# EAGLE design AJH_MM_v1_0 (EAGLE 9.6.2)
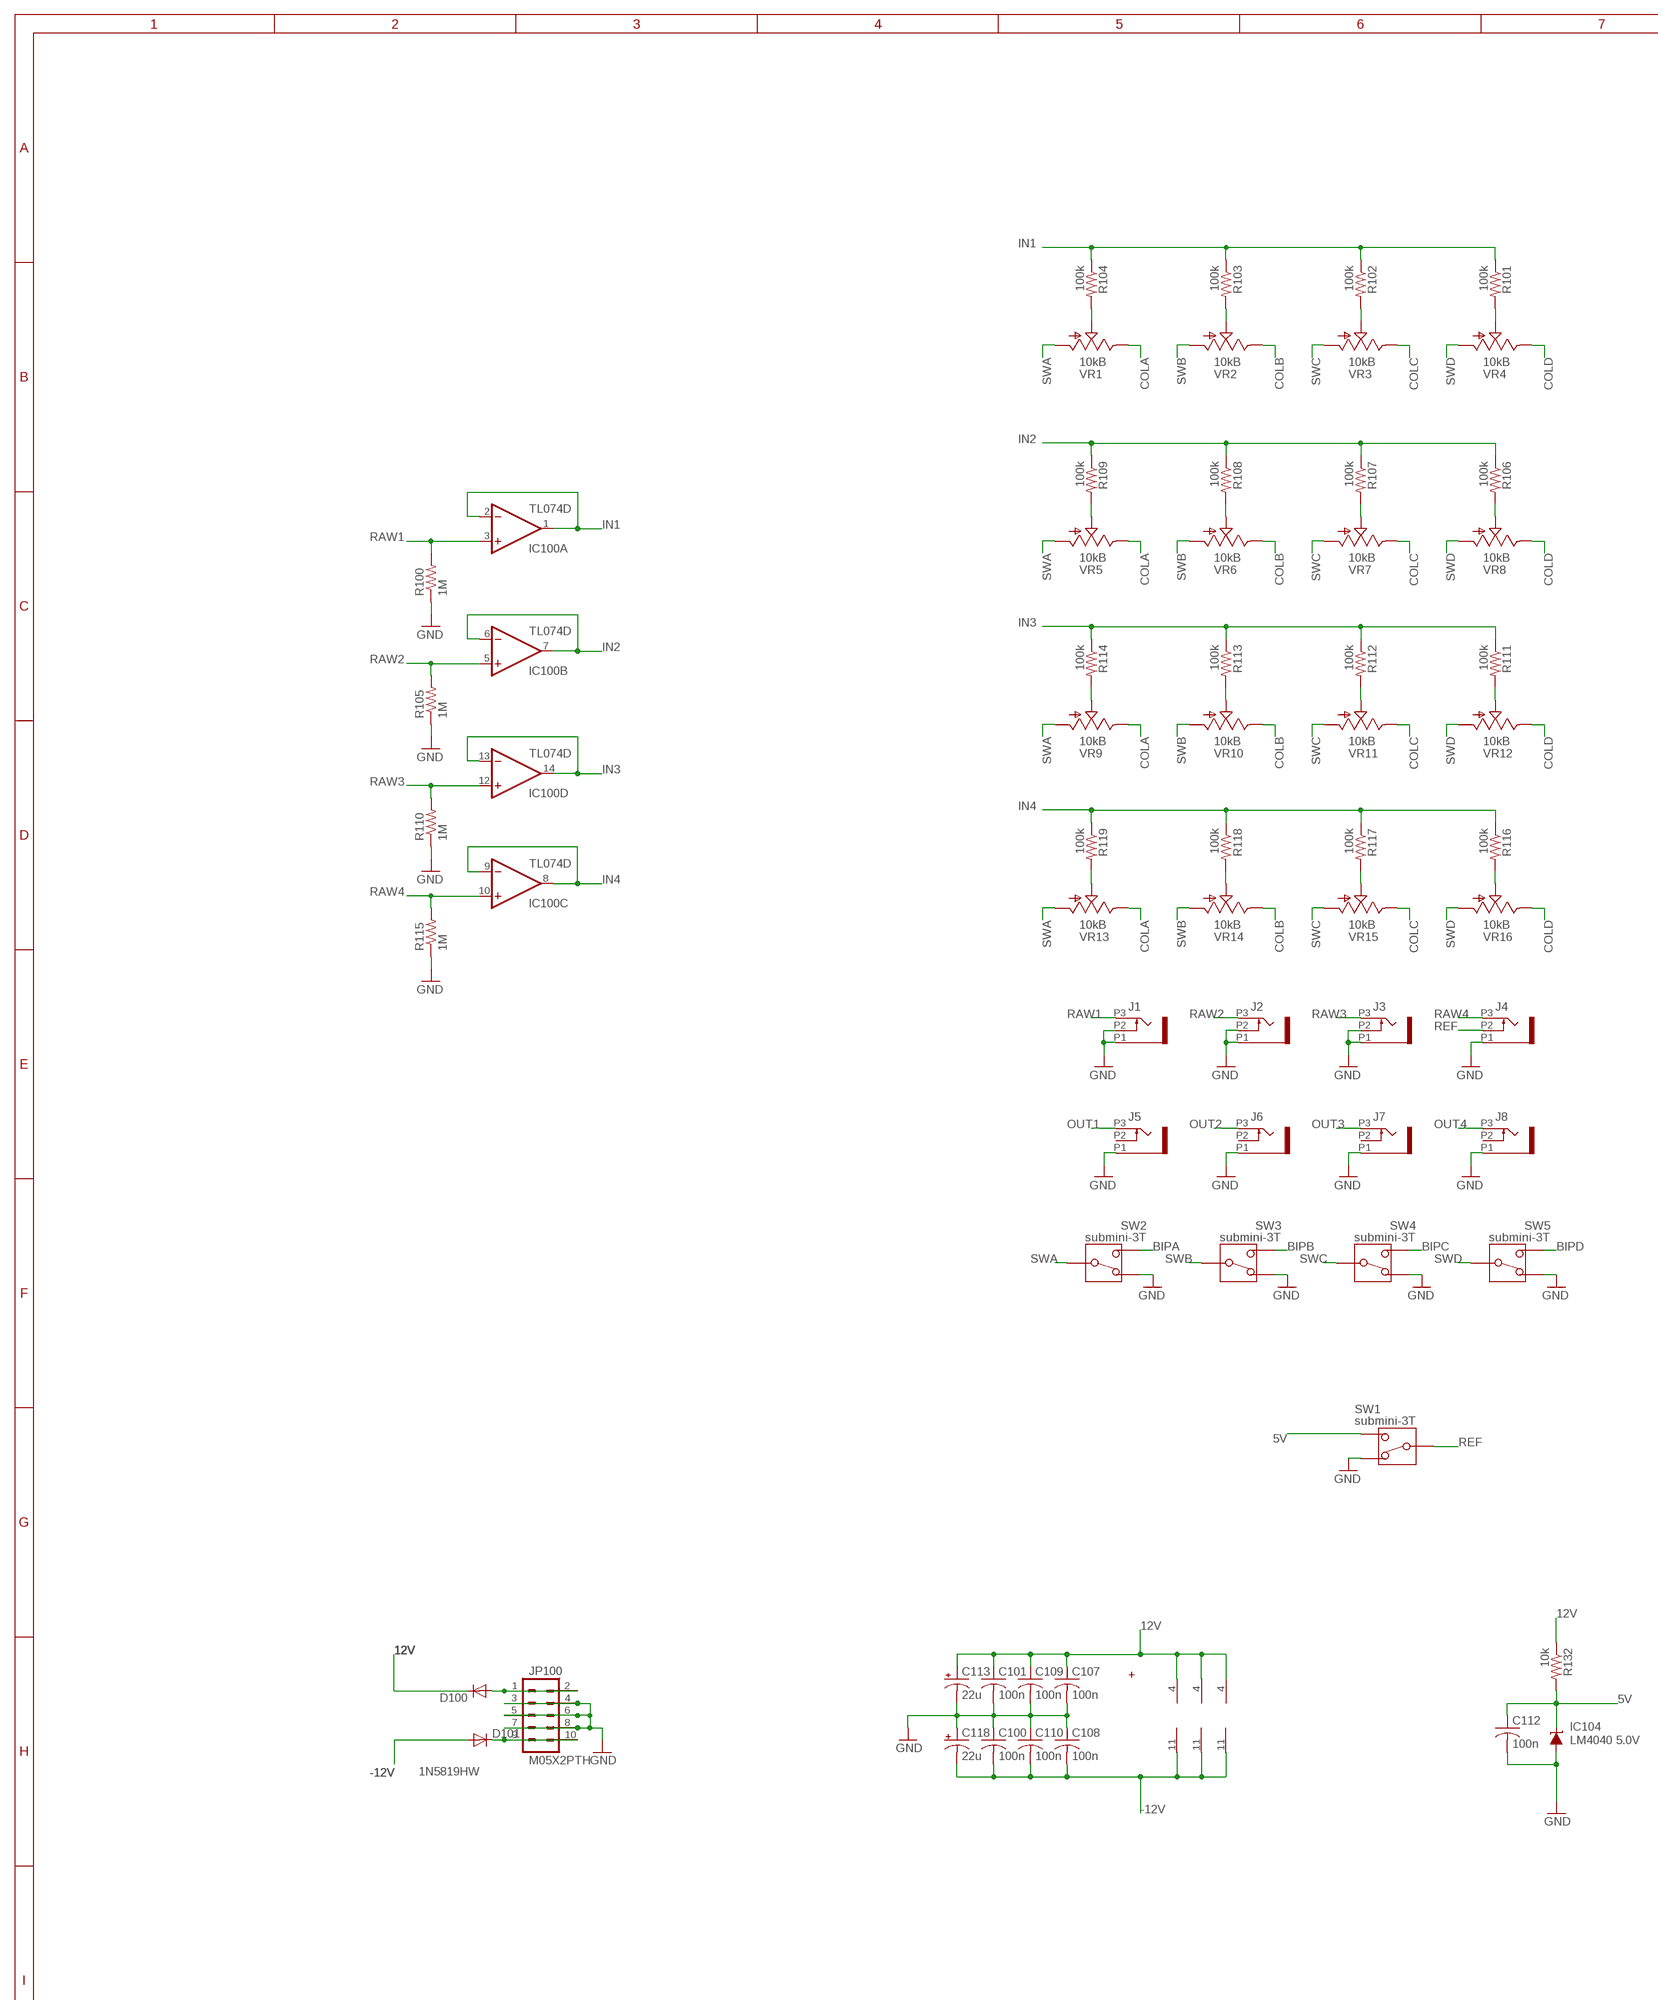
[diagram p0: schematic, sheet 1, part 1 of 2]
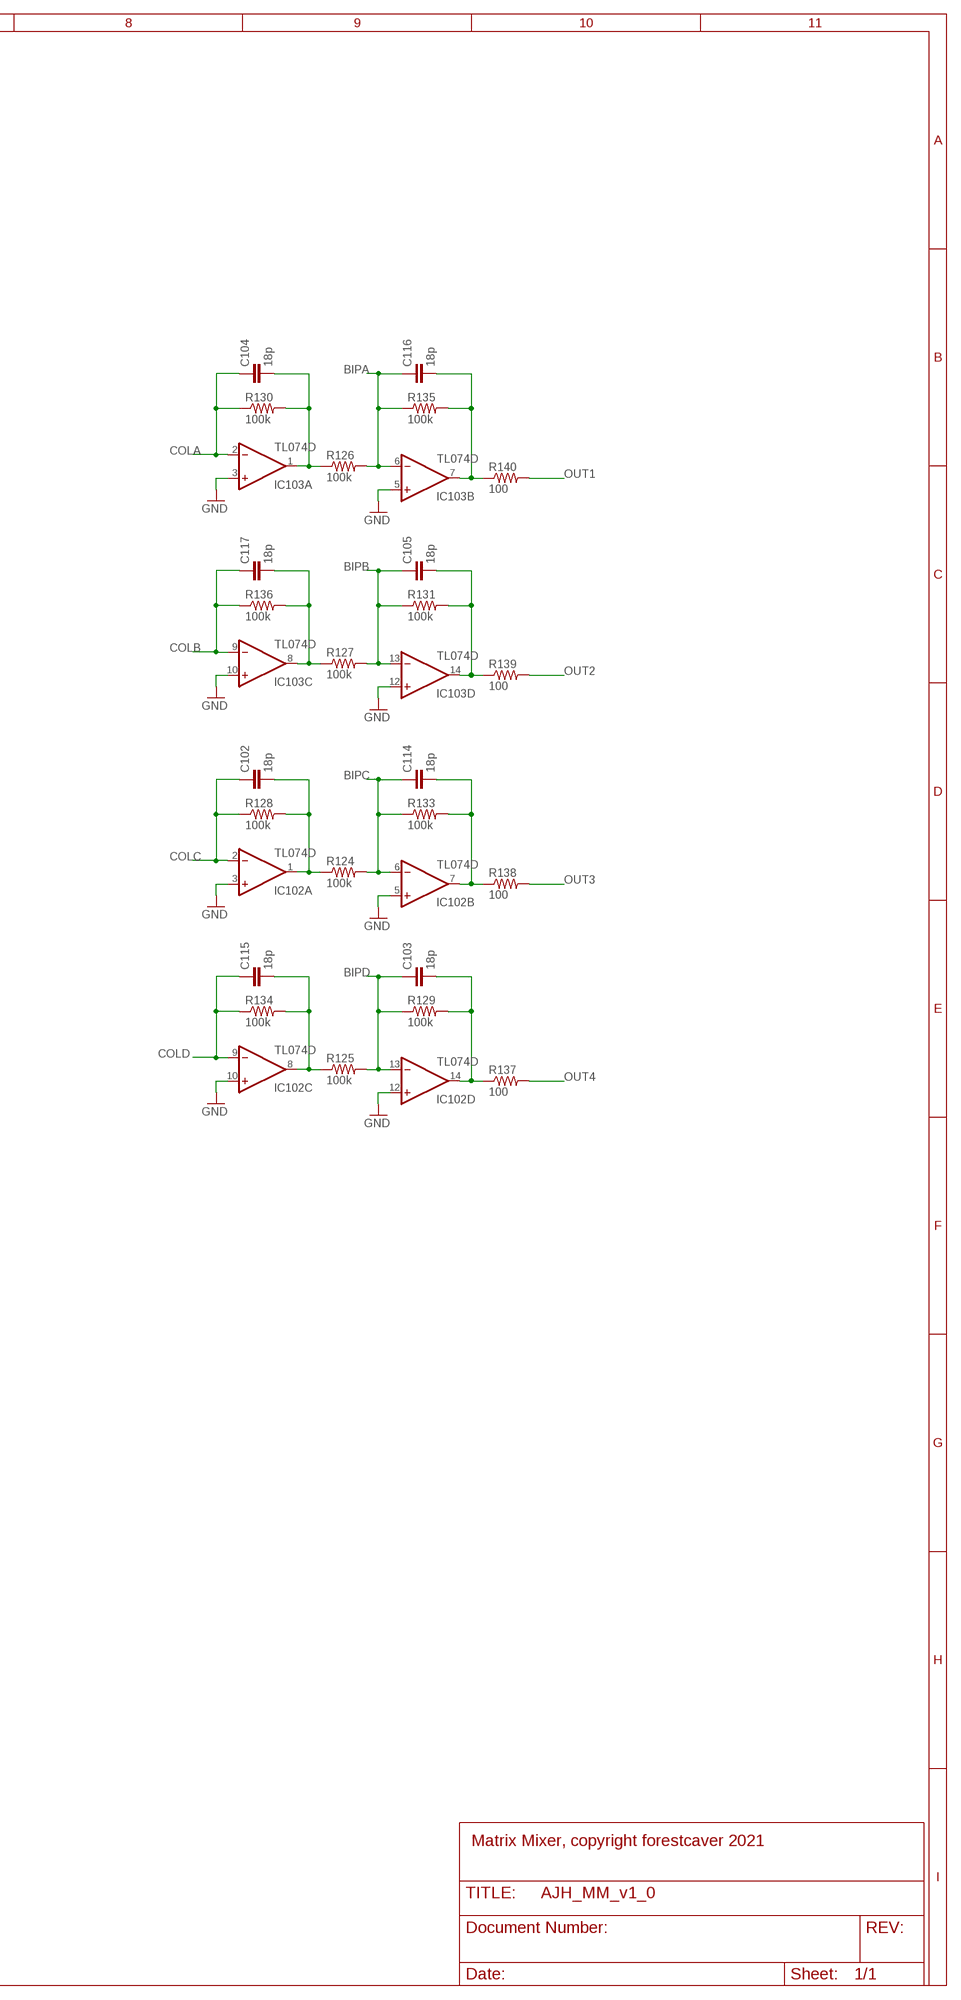
[diagram p1: schematic, sheet 1, part 2 of 2]

## Parts
C100  100n  C-USC0603  [C0603]
C101  100n  C-USC0603  [C0603]
C102  18p  C-EUC0603  [C0603]
C103  18p  C-EUC0603  [C0603]
C104  18p  C-EUC0603  [C0603]
C105  18p  C-EUC0603  [C0603]
C107  100n  C-USC0603  [C0603]
C108  100n  C-USC0603  [C0603]
C109  100n  C-USC0603  [C0603]
C110  100n  C-USC0603  [C0603]
C112  100n  C-USC0603  [C0603]
C113  22u  CPOL-USB  [PANASONIC_B]
C114  18p  C-EUC0603  [C0603]
C115  18p  C-EUC0603  [C0603]
C116  18p  C-EUC0603  [C0603]
C117  18p  C-EUC0603  [C0603]
C118  22u  CPOL-USB  [PANASONIC_B]
D100  1N5819HW  DIODE-SOD123  [SOD123]
D101  1N5819HW  DIODE-SOD123  [SOD123]
IC100  TL074D  [SO14]
IC102  TL074D  [SO14]
IC103  TL074D  [SO14]
IC104  LM4040 5.0V  LM4041C12DBZ  [DBZ_R-PDSO-G3]
J1  PJ301_THONKICONN6  [WQP_PJ_301M6]
J2  PJ301_THONKICONN6  [WQP_PJ_301M6]
J3  PJ301_THONKICONN6  [WQP_PJ_301M6]
J4  PJ301_THONKICONN6  [WQP_PJ_301M6]
J5  PJ301_THONKICONN6  [WQP_PJ_301M6]
J6  PJ301_THONKICONN6  [WQP_PJ_301M6]
J7  PJ301_THONKICONN6  [WQP_PJ_301M6]
J8  PJ301_THONKICONN6  [WQP_PJ_301M6]
JP100  M05X2PTH  [AVR_ICSP]
R100  1M  R-US_R0603  [R0603]
R101  100k  R-US_R0603  [R0603]
R102  100k  R-US_R0603  [R0603]
R103  100k  R-US_R0603  [R0603]
R104  100k  R-US_R0603  [R0603]
R105  1M  R-US_R0603  [R0603]
R106  100k  R-US_R0603  [R0603]
R107  100k  R-US_R0603  [R0603]
R108  100k  R-US_R0603  [R0603]
R109  100k  R-US_R0603  [R0603]
R110  1M  R-US_R0603  [R0603]
R111  100k  R-US_R0603  [R0603]
R112  100k  R-US_R0603  [R0603]
R113  100k  R-US_R0603  [R0603]
R114  100k  R-US_R0603  [R0603]
R115  1M  R-US_R0603  [R0603]
R116  100k  R-US_R0603  [R0603]
R117  100k  R-US_R0603  [R0603]
R118  100k  R-US_R0603  [R0603]
R119  100k  R-US_R0603  [R0603]
R124  100k  R-US_R0603  [R0603]
R125  100k  R-US_R0603  [R0603]
R126  100k  R-US_R0603  [R0603]
R127  100k  R-US_R0603  [R0603]
R128  100k  R-US_R0603  [R0603]
R129  100k  R-US_R0603  [R0603]
R130  100k  R-US_R0603  [R0603]
R131  100k  R-US_R0603  [R0603]
R132  10k  R-US_R0603  [R0603]
R133  100k  R-US_R0603  [R0603]
R134  100k  R-US_R0603  [R0603]
R135  100k  R-US_R0603  [R0603]
R136  100k  R-US_R0603  [R0603]
R137  100  R-US_R0603  [R0603]
R138  100  R-US_R0603  [R0603]
R139  100  R-US_R0603  [R0603]
R140  100  R-US_R0603  [R0603]
SW1  submini-3T  SPDTT  [SPDT-SUB]
SW2  submini-3T  SPDTT  [SPDT-SUB]
SW3  submini-3T  SPDTT  [SPDT-SUB]
SW4  submini-3T  SPDTT  [SPDT-SUB]
SW5  submini-3T  SPDTT  [SPDT-SUB]
VR1  10kB  POT_USVERTICAL  [ALPS_POT_VERTICAL]
VR2  10kB  POT_USVERTICAL  [ALPS_POT_VERTICAL]
VR3  10kB  POT_USVERTICAL  [ALPS_POT_VERTICAL]
VR4  10kB  POT_USVERTICAL  [ALPS_POT_VERTICAL]
VR5  10kB  POT_USVERTICAL  [ALPS_POT_VERTICAL]
VR6  10kB  POT_USVERTICAL  [ALPS_POT_VERTICAL]
VR7  10kB  POT_USVERTICAL  [ALPS_POT_VERTICAL]
VR8  10kB  POT_USVERTICAL  [ALPS_POT_VERTICAL]
VR9  10kB  POT_USVERTICAL  [ALPS_POT_VERTICAL]
VR10  10kB  POT_USVERTICAL  [ALPS_POT_VERTICAL]
VR11  10kB  POT_USVERTICAL  [ALPS_POT_VERTICAL]
VR12  10kB  POT_USVERTICAL  [ALPS_POT_VERTICAL]
VR13  10kB  POT_USVERTICAL  [ALPS_POT_VERTICAL]
VR14  10kB  POT_USVERTICAL  [ALPS_POT_VERTICAL]
VR15  10kB  POT_USVERTICAL  [ALPS_POT_VERTICAL]
VR16  10kB  POT_USVERTICAL  [ALPS_POT_VERTICAL]

## Nets
5V: C112.1 IC104.1(C) R132.2 SW1.P$1
12V [power]: C101.1 C107.1 C109.1 C113.+ D100.C IC100.4(P:V+) IC102.4(P:V+) IC103.4(P:V+) R132.1
-12V [power]: C100.2 C108.2 C110.2 C118.- D101.A IC100.11(P:V-) IC102.11(P:V-) IC103.11(P:V-)
BIPA: C116.1 IC103.6(B:-IN) R126.2 R135.1 SW2.P$1
BIPB: C105.1 IC103.13(D:-IN) R127.2 R131.1 SW3.P$1
BIPC: C114.1 IC102.6(B:-IN) R124.2 R133.1 SW4.P$1
BIPD: C103.1 IC102.13(D:-IN) R125.2 R129.1 SW5.P$1
COLA: C104.1 IC103.2(A:-IN) R130.1 VR1.P$1(E) VR5.P$1(E) VR9.P$1(E) VR13.P$1(E)
COLB: C117.1 IC103.9(C:-IN) R136.1 VR2.P$1(E) VR6.P$1(E) VR10.P$1(E) VR14.P$1(E)
COLC: C102.1 IC102.2(A:-IN) R128.1 VR3.P$1(E) VR7.P$1(E) VR11.P$1(E) VR15.P$1(E)
COLD: C115.1 IC102.9(C:-IN) R134.1 VR4.P$1(E) VR8.P$1(E) VR12.P$1(E) VR16.P$1(E)
GND [power]: C100.1 C101.2 C107.2 C108.1 C109.2 C110.1 C112.2 C113.- C118.+ IC102.3(A:+IN) IC102.5(B:+IN) IC102.10(C:+IN) IC102.12(D:+IN) IC103.3(A:+IN) IC103.5(B:+IN) IC103.10(C:+IN) IC103.12(D:+IN) IC104.2(A) J1.P1 J1.P2 J2.P1 J2.P2 J3.P1 J3.P2 J4.P1 J5.P1 J6.P1 J7.P1 J8.P1 JP100.3 JP100.4 JP100.5 JP100.6 JP100.7 JP100.8 R100.1 R105.1 R110.1 R115.1 SW1.P$3 SW2.P$3 SW3.P$3 SW4.P$3 SW5.P$3
IN1: IC100.1(A:OUT) IC100.2(A:-IN) R101.1 R102.1 R103.1 R104.1
IN2: IC100.6(B:-IN) IC100.7(B:OUT) R106.1 R107.1 R108.1 R109.1
IN3: IC100.13(D:-IN) IC100.14(D:OUT) R111.1 R112.1 R113.1 R114.1
IN4: IC100.8(C:OUT) IC100.9(C:-IN) R116.1 R117.1 R118.1 R119.1
N$2: R104.2 VR1.P$2(S)
N$3: R103.2 VR2.P$2(S)
N$4: R102.2 VR3.P$2(S)
N$5: R101.2 VR4.P$2(S)
N$6: D100.A JP100.1 JP100.2
N$7: R114.2 VR9.P$2(S)
N$8: C117.2 IC103.8(C:OUT) R127.1 R136.2
N$9: R113.2 VR10.P$2(S)
N$10: R112.2 VR11.P$2(S)
N$11: R111.2 VR12.P$2(S)
N$12: C104.2 IC103.1(A:OUT) R126.1 R130.2
N$13: R119.2 VR13.P$2(S)
N$14: R118.2 VR14.P$2(S)
N$15: R117.2 VR15.P$2(S)
N$16: R116.2 VR16.P$2(S)
N$18: C116.2 IC103.7(B:OUT) R135.2 R140.1
N$20: D101.C JP100.9 JP100.10
N$21: C105.2 IC103.14(D:OUT) R131.2 R139.1
N$22: R109.2 VR5.P$2(S)
N$24: R108.2 VR6.P$2(S)
N$28: C102.2 IC102.1(A:OUT) R124.1 R128.2
N$30: C114.2 IC102.7(B:OUT) R133.2 R138.1
N$31: C115.2 IC102.8(C:OUT) R125.1 R134.2
N$33: C103.2 IC102.14(D:OUT) R129.2 R137.1
N$34: R107.2 VR7.P$2(S)
N$38: R106.2 VR8.P$2(S)
OUT1: J5.P3 R140.2
OUT2: J6.P3 R139.2
OUT3: J7.P3 R138.2
OUT4: J8.P3 R137.2
RAW1: IC100.3(A:+IN) J1.P3 R100.2
RAW2: IC100.5(B:+IN) J2.P3 R105.2
RAW3: IC100.12(D:+IN) J3.P3 R110.2
RAW4: IC100.10(C:+IN) J4.P3 R115.2
REF: J4.P2 SW1.P$2
SWA: SW2.P$2 VR1.P$3(A) VR5.P$3(A) VR9.P$3(A) VR13.P$3(A)
SWB: SW3.P$2 VR2.P$3(A) VR6.P$3(A) VR10.P$3(A) VR14.P$3(A)
SWC: SW4.P$2 VR3.P$3(A) VR7.P$3(A) VR11.P$3(A) VR15.P$3(A)
SWD: SW5.P$2 VR4.P$3(A) VR8.P$3(A) VR12.P$3(A) VR16.P$3(A)
Unconnected: J5.P2 J6.P2 J7.P2 J8.P2

## Notes on the sheet
- +
- Matrix Mixer, copyright forestcaver 2021

## Library data of the parts
C100 C101 C107-C110 C112 = rcl:C-US: CAPACITOR, American symbol
C102-C105 C114-C117 = resistor:C-EU: CAPACITOR, European symbol
C113 C118 = rcl:CPOL-US: POLARIZED CAPACITOR, American symbol
D100 D101 = diode:DIODE-: DIODE
IC100 IC102 IC103 = linear:TL074: OP AMP
IC104 = texas:LM4041: PRECISION MICROPOWER SHUNT VOLTAGE REFERENCE Source: http://focus.ti.com/lit/ds/slcs146e/slcs146e.pdf
J1-J8 = og-pj301_variations:PJ301_THONKICONN
JP100 = og-header:M05X2: Header 5x2 Standard 10-pin dual row 0.1" header. Commonly used with AVR-ISP. Use with Spark Fun Electronics SKU: PRT-00778
R100-R119 R124-R140 = resistor:R-US_: RESISTOR, American symbol
SW1-SW5 = malekko main:SPDT: SPDT Switch
VR1-VR16 = og-pots:POT_US

## Net classes
1 power: width 0.178 mm, drill 0.305 mm, clearance 0.178 mm to class 0, clearance 0.178 mm

## Board
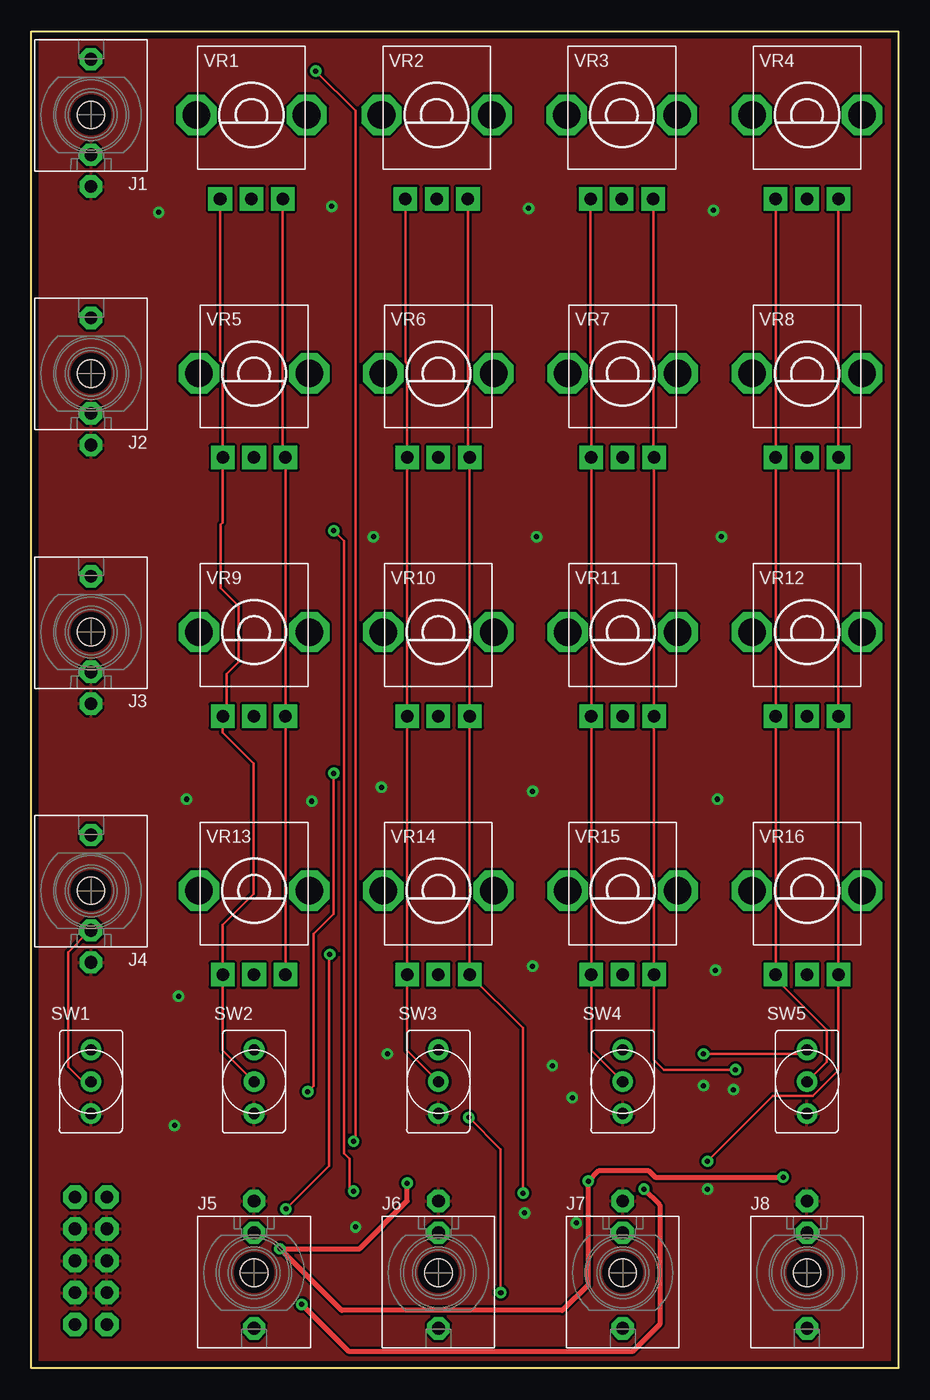
[diagram p2: board, top side]
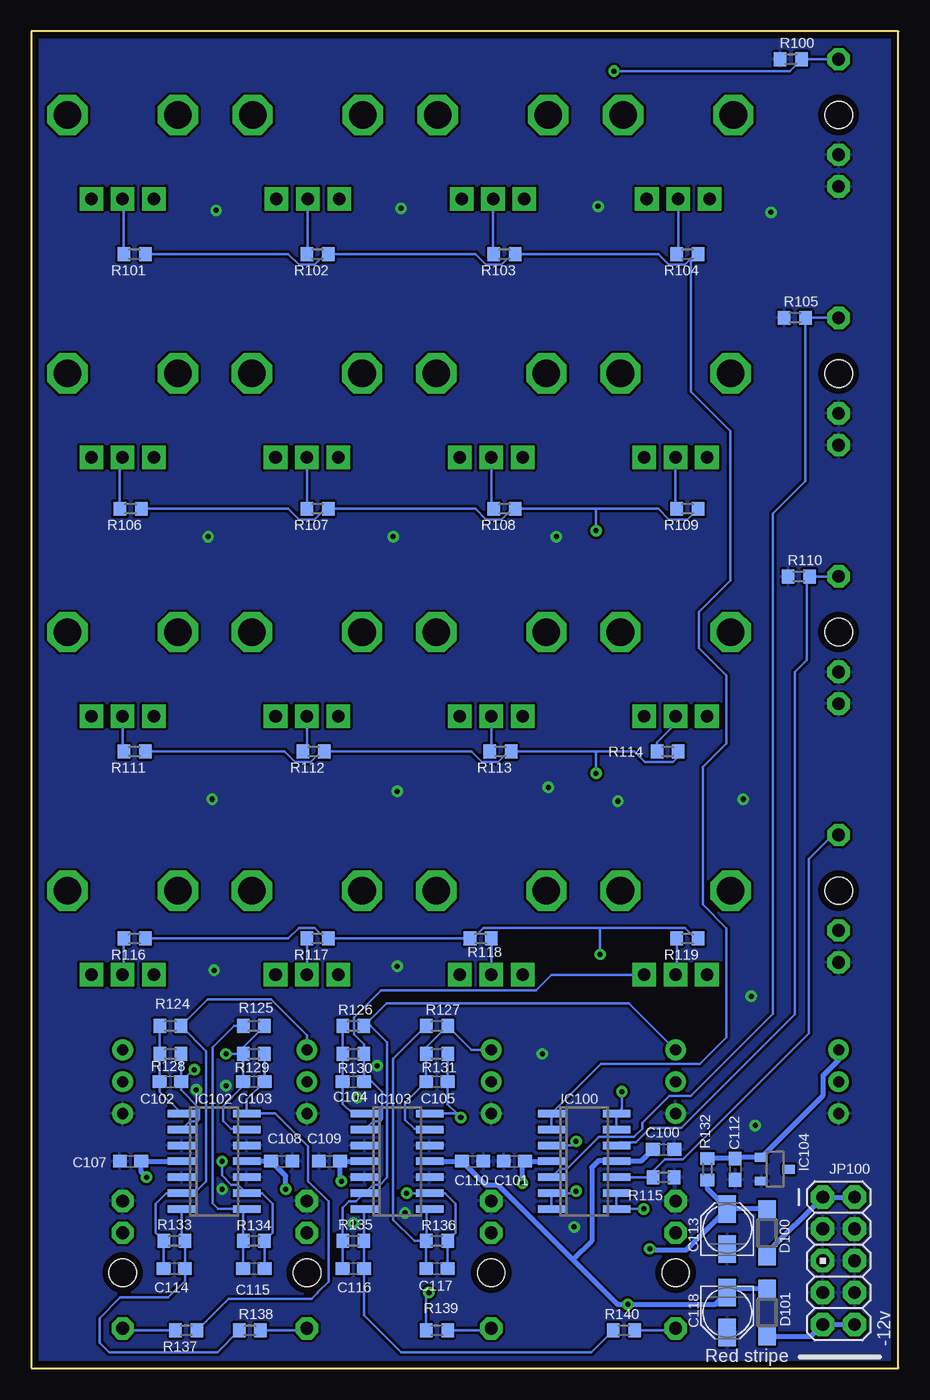
[diagram p3: board, bottom side, seen from below]

Size 69.2 x 106.68 mm. Coordinates in mm from the lower left corner, seen from the top.
Outline: 0,0 0,106.68 69.2,106.68 69.2,0 0,0
Copper layers (1*16): Top 0.035mm / dielectric 1.5mm / Bottom 0.035mm
Design rules "jinx": minimum track width 8mil, minimum drill 0.4mm, track to track 8mil, track to pad 8mil, pad to pad 8mil, via to via 8mil, smd to smd 8mil, copper to edge 20mil, drill to drill 8mil, minimum pad ring 8mil, minimum via ring 10mil, stop-mask expansion 3mil, vias tented up to drill 25mil, thermal gap 8mil

### Footprints (pad centres in the part's own frame; a part is rotated, then mirrored left to right if it is on the bottom)
C0603 = smd 1.1 x 1: 1 -0.85,0; 2 0.85,0
PANASONIC_B = smd 2.2 x 1.4: + 1.6,0; - -1.6,0
SOD123 = smd 1.4 x 1.4: A 1.9,0; C -1.9,0
SO14 = smd 0.6 x 2.2: 1 -3.81,-2.6; 2 -2.54,-2.6; 3 -1.27,-2.6; 4 0,-2.6; 5 1.27,-2.6; 6 2.54,-2.6; 7 3.81,-2.6; 8 3.81,2.6; 9 2.54,2.6; 10 1.27,2.6; 11 0,2.6; 12 -1.27,2.6; 13 -2.54,2.6; 14 -3.81,2.6
DBZ_R-PDSO-G3 = smd 0.7 x 1: 1 -0.95,-1.1; 2 0.95,-1.1; 3 0,1.1
WQP_PJ_301M6 = drill 1.016 pad 1.778 octagon: P1 0,-5.715; P2 0,-3.175; P3 0,4.445 | hole 2.2: 0,0
AVR_ICSP = drill 1.016 pad 1.88 octagon: 1 -1.27,5.08; 2 1.27,5.08; 3 -1.27,2.54; 4 1.27,2.54; 5 -1.27,0; 6 1.27,0; 7 -1.27,-2.54; 8 1.27,-2.54; 9 -1.27,-5.08; 10 1.27,-5.08
R0603 = smd 1 x 1.1: 1 -0.85,0; 2 0.85,0
SPDT-SUB = drill 0.889 pad 1.651: P$1 0,2.54; P$2 0,0; P$3 0,-2.54
ALPS_POT_VERTICAL = drill 1 pad 1.88 square: P$1 -2.5,6.7; P$2 0,6.7; P$3 2.5,6.7 | drill 2.2 pad 3.175 octagon: P$4 -4.4,0; P$5 4.4,0

### Placement (x,y rotation side)
C100  18.73,17.46 180 bottom
C101  30.64,16.51 180 bottom
C102  58.1,22.86 180 bottom
C103  51.44,22.86 0 bottom
C104  43.5,22.86 180 bottom
C105  36.83,22.86 0 bottom
C107  61.28,16.51 180 bottom
C108  49.21,16.51 180 bottom
C109  45.4,16.51 180 bottom
C110  33.97,16.51 180 bottom
C112  13.02,15.88 270 bottom
C113  13.65,11.11 90 bottom
C114  57.78,7.94 0 bottom
C115  51.44,7.94 180 bottom
C116  43.5,7.94 0 bottom
C117  36.83,7.94 180 bottom
C118  13.65,4.45 270 bottom
D100  10.48,10.79 270 bottom
D101  10.48,4.45 90 bottom
IC100  25.08,16.51 270 bottom
IC102  54.61,16.51 270 bottom
IC103  40.01,16.51 270 bottom
IC104  9.84,15.88 270 bottom
J1  4.76,100.01 0 top
J2  4.76,79.38 0 top
J3  4.76,58.74 0 top
J4  4.76,38.1 0 top
J5  17.78,7.62 180 top
J6  32.49,7.62 180 top
J7  47.2,7.62 180 top
J8  61.91,7.62 180 top
JP100  4.76,8.57 0 bottom
R100  8.57,104.46 0 bottom
R101  60.96,88.9 180 bottom
R102  46.35,88.9 180 bottom
R103  31.43,88.9 180 bottom
R104  16.83,88.9 180 bottom
R105  8.26,83.82 0 bottom
R106  61.28,68.58 180 bottom
R107  46.35,68.58 180 bottom
R108  31.43,68.58 180 bottom
R109  16.83,68.58 180 bottom
R110  7.94,63.18 0 bottom
R111  60.96,49.21 180 bottom
R112  46.67,49.21 180 bottom
R113  31.75,49.21 180 bottom
R114  18.41,49.21 180 bottom
R115  18.73,15.24 180 bottom
R116  60.96,34.29 180 bottom
R117  46.35,34.29 180 bottom
R118  33.34,34.29 0 bottom
R119  16.83,34.29 180 bottom
R124  58.1,27.3 0 bottom
R125  51.44,27.3 0 bottom
R126  43.5,27.3 0 bottom
R127  36.83,27.3 0 bottom
R128  58.1,25.08 180 bottom
R129  51.44,25.08 0 bottom
R130  43.5,25.08 180 bottom
R131  36.83,25.08 0 bottom
R132  15.24,15.88 90 bottom
R133  57.78,10.16 0 bottom
R134  51.44,10.16 180 bottom
R135  43.5,10.16 0 bottom
R136  36.83,10.16 180 bottom
R137  56.83,3.02 180 bottom
R138  51.75,3.02 0 bottom
R139  36.83,3.02 0 bottom
R140  21.91,3.02 0 bottom
SW1  4.76,22.86 0 top
SW2  17.78,22.86 0 top
SW3  32.49,22.86 0 top
SW4  47.2,22.86 0 top
SW5  61.91,22.86 0 top
VR1  17.57,100.01 180 top
VR2  32.35,100.01 180 top
VR3  47.13,100.01 180 top
VR4  61.91,100.01 180 top
VR5  17.78,79.38 180 top
VR6  32.49,79.38 180 top
VR7  47.2,79.38 180 top
VR8  61.91,79.38 180 top
VR9  17.78,58.74 180 top
VR10  32.49,58.74 180 top
VR11  47.2,58.74 180 top
VR12  61.91,58.74 180 top
VR13  17.78,38.1 180 top
VR14  32.49,38.1 180 top
VR15  47.2,38.1 180 top
VR16  61.91,38.1 180 top

### Tracks (layer width: path | path; a pad name or v marks a point on that pad's centre or on a via)
5V
  Bottom 0.406: SW1.P$1 4.76,24.6 5.99,23.37 5.99,21.77 IC104.1 12.92,16.82 C112.1 R132.2
12V  (via drill 0.4)
  Top 0.406: v60.01,15.24 49.79,15.24 49.25,15.78 45.31,15.78 v44.45,14.92 44.45,6.67 42.39,4.6 24.77,4.6 v19.84,9.53 26.19,9.53 30,13.34 v30,14.76
  Bottom 0.406: IC102.4 C107.1 60.43,15.66 v60.01,15.24 | IC103.4 C109.1 44.55,15.03 v44.45,14.92 | C113.+ 16.93,9.43 19.75,9.43 v19.84,9.53 | C113.+ 15.24,14.3 R132.1 | v30,14.76 30,16.51 C101.1 IC100.4 | D100.C 10.49,12.71 C113.+
-12V  (via drill 0.4)
  Top 0.406: v21.59,5.08 25.31,1.36 48.03,1.36 50.16,3.49 50.16,13.02 v48.9,14.29
  Bottom 0.406: D101.A 13.35,6.34 C118.- 14.62,5.08 v21.59,5.08 22.4,5.08 25.97,8.64 | v48.9,14.29 48.9,15.34 C108.2 IC102.11 | IC103.11 C110.2 32.94,14.63 31.95,14.63 25.97,8.64 | C100.2 20.54,16.51 IC100.11 22.55,16.58 23.91,16.58 24.46,16.03 24.46,10.14 25.97,8.64
BIPA
  Bottom 0.203: C116.1 R135.1 44.35,12.79 43.83,13.3 43.27,13.3 IC103.6 41.94,14.63 41.38,14.63 40.79,15.22 40.79,25.98 42.12,27.3 R126.2 40.84,29.11 21.49,29.11 SW2.P$1
BIPB
  Bottom 0.203: SW3.P$1 34.08,25.4 R127.2 37.68,25.61 R131.1 C105.1 39.37,21.17 39.37,19.82 38.63,19.08 37.44,19.08 IC103.13
BIPC
  Bottom 0.203: C114.1 R133.1 59.27,10.79 59.27,13.11 58.44,13.94 57.24,13.94 IC102.6 56.2,13.97 55.24,14.92 55.24,25.3 R124.2 55.13,29.43 50.07,29.43 47.2,26.56 SW4.P$1
BIPD  (via drill 0.4)
  Top 0.203: SW5.P$1 61.59,25.08 v53.66,25.08
  Bottom 0.203: R129.1 C103.1 52.28,22.51 53.89,20.91 53.89,19.73 53.24,19.08 52.04,19.08 IC102.13 | v53.66,25.08 R129.1 | R125.2 52.28,25.61 R129.1
COLA
  Top 0.203: VR1.P$1 20.07,72.89 VR5.P$1 20.28,59.54 20.27,59.53 20.27,57.95 20.28,57.93 VR9.P$1 20.28,38.91 20.27,38.89 20.27,37.31 20.28,37.3 VR13.P$1
  Bottom 0.203: IC103.2 41.94,19.71 41.38,19.71 41.2,19.89 41.2,22.05 42.01,22.86 C104.1 R130.1 42.65,25.82 43.45,26.63 43.45,27.98 41.28,30.16 28.93,30.16 27.68,31.4 VR13.P$1
COLB  (via drill 0.4)
  Top 0.203: VR2.P$1 34.85,72.81 VR6.P$1 34.99,59.54 34.98,59.53 34.98,57.95 34.99,57.93 VR10.P$1 34.99,38.91 34.98,38.89 34.98,37.31 34.99,37.3 VR14.P$1 39.25,27.14 v39.25,13.97
  Bottom 0.203: C117.1 R136.1 35.34,10.79 35.34,13.12 36.2,13.97 IC103.9 v39.25,13.97
COLC  (via drill 0.4)
  Top 0.203: VR3.P$1 49.63,72.75 VR7.P$1 49.7,59.54 49.69,59.53 49.69,57.95 49.7,57.93 VR11.P$1 49.7,38.91 49.69,38.89 49.69,37.31 49.7,37.3 VR15.P$1 49.7,24.59 50.48,23.81 v56.2,23.81
  Bottom 0.203: R128.1 C102.1 | C102.1 57.25,22.19 55.8,20.75 55.8,19.89 55.98,19.71 56.55,19.71 IC102.2 | C102.1 56.3,23.81 v56.2,23.81
COLD  (via drill 0.4)
  Top 0.203: VR4.P$1 64.41,80.18 64.4,80.17 64.4,78.58 64.41,78.57 VR8.P$1 64.41,59.54 64.4,59.53 64.4,57.95 64.41,57.93 VR12.P$1 64.41,38.91 64.4,38.89 64.4,37.31 64.41,37.3 VR16.P$1 64.41,23.76 62.38,21.73 59.2,21.73 v53.98,16.51
  Bottom 0.203: C115.1 R134.1 49.95,10.79 49.95,13.11 50.78,13.94 51.98,13.94 IC102.9 52.67,14.63 53.24,14.63 53.98,15.37 v53.98,16.51
GND  (via drill 0.4)
  other vias: 53.98,14.29 39.37,12.38 53.66,22.54 41.59,24.13 43.18,21.59 11.43,19.37 25.88,11.27 28.42,25.08 11.75,29.69 40.01,32.07 54.61,31.75 54.77,45.4 40.01,46.04 22.38,45.24 12.38,45.4 27.3,66.36 40.32,66.36 55.09,66.36 54.45,92.39 39.69,92.55 23.97,92.71 10.16,92.23 27.94,46.35 56.04,22.23 43.5,11.59
  pour Top: 0,106.68 69.22,106.68 69.22,0 0,0
  pour Bottom: 0,106.68 69.22,106.68 69.22,0 0,0
IN1
  Bottom 0.203: R101.1 48.69,88.9 47.83,88.05 46.58,88.05 45.72,88.9 R102.1 33.76,88.9 32.91,88.05 31.66,88.05 30.8,88.9 R103.1 19.16,88.9 18.3,88.05 17.05,88.05 16.2,88.9 R104.1 16.56,88.31 16.56,77.95 13.4,74.78 13.4,62.85 15.93,60.32 15.93,57.47 13.72,55.26 13.72,49.86 15.61,47.97 15.61,36.99 13.72,35.1 13.72,26.41 15.86,24.27 23.73,24.27 IC100.1 IC100.2
IN2  (via drill 0.4)
  Top 0.203: v25.72,14.13 25.4,14.45 25.4,16.71 24.96,17.15 24.96,66 v24.13,66.83
  Bottom 0.203: IC100.7 IC100.6 25.88,13.97 v25.72,14.13 | 24.29,68.58 19.16,68.58 18.3,67.72 16.83,67.72 R109.1 | 24.29,68.58 R108.1 30.8,68.58 31.66,67.72 32.91,67.72 33.76,68.58 R107.1 45.72,68.58 46.58,67.72 47.83,67.72 48.69,68.58 R106.1 | v24.13,66.83 24.13,68.42 24.29,68.58
IN3  (via drill 0.4)
  Top 0.203: v24.13,47.47 24.13,36.23 22.54,34.65 22.54,22.54 v22.07,22.07
  Bottom 0.203: R111.1 49,49.21 48.15,48.36 46.9,48.36 46.04,49.21 R112.1 34.08,49.21 33.23,48.36 31.97,48.36 31.12,49.21 R113.1 24.13,49.21 | 24.13,49.21 21.06,49.21 20.21,48.36 18,48.36 17.57,48.8 R114.1 | IC100.13 IC100.14 22.07,20.74 v22.07,22.07 | v24.13,47.47 24.13,49.21
IN4  (via drill 0.4)
  Top 0.203: v23.81,33.02 23.75,32.95 23.75,16.13 v20.32,12.7
  Bottom 0.203: IC100.9 IC100.8 v20.32,12.7 | R119.1 16.2,34.29 17.05,35.15 23.81,35.15 | 23.81,35.15 33.11,35.15 33.97,34.29 R118.1 R117.1 45.72,34.29 46.58,35.15 47.83,35.15 48.69,34.29 R116.1 | v23.81,33.02 23.81,35.15
N$2
  Bottom 0.203: VR1.P$2 17.57,89.01 R104.2
N$3
  Bottom 0.203: VR2.P$2 32.35,88.97 R103.2
N$4
  Bottom 0.203: VR3.P$2 47.13,88.97 R102.2
N$5
  Bottom 0.203: R101.2 61.81,93.21 VR4.P$2
N$6
  Bottom 0.406: JP100.2 JP100.1 10.48,9.21 D100.A
N$7
  Bottom 0.203: VR9.P$2 17.78,51.4 19.27,49.92 R114.2
N$8
  Bottom 0.203: R127.1 40.32,24.66 40.32,11.85 38.63,10.16 R136.2 | C117.2 R136.2 | R136.2 37.65,10.19 37.65,12.45 IC103.8
N$9
  Bottom 0.203: VR10.P$2 32.49,49.32 R113.2
N$10
  Bottom 0.203: VR11.P$2 47.2,49.53 R112.2
N$11
  Bottom 0.203: VR12.P$2 61.91,49.31 R111.2
N$12
  Bottom 0.203: R126.1 R130.2 C104.2 44.35,21.11 43.56,20.32 IC103.1
N$13
  Bottom 0.203: R119.2 17.68,31.5 VR13.P$2
N$14
  Bottom 0.203: R118.2 VR14.P$2
N$15
  Bottom 0.203: R117.2 VR15.P$2
N$16
  Bottom 0.203: R116.2 61.81,31.5 VR16.P$2
N$18
  Bottom 0.203: IC103.7 42.65,12.66 R135.2 C116.2 42.65,4.23 39.69,1.27 24.5,1.27 R140.1
N$20
  Bottom 0.406: JP100.10 JP100.9 6.98,2.54 D101.C
N$21  (via drill 0.4)
  Top 0.203: v37.47,6.03 37.47,17.46 v34.92,20
  Bottom 0.203: R131.2 C105.2 35.98,21.06 35.24,20.32 | R139.1 37.68,5.82 v37.47,6.03 | v34.92,20 35.24,20.32 | 35.24,20.32 IC103.14
N$22
  Bottom 0.203: VR5.P$2 17.78,68.68 R109.2
N$24
  Bottom 0.203: VR6.P$2 32.49,68.79 R108.2
N$28
  Bottom 0.203: R124.1 R128.2 C102.2 58.95,22.06 IC102.1
N$30
  Bottom 0.203: IC102.7 57.21,10.44 R133.2 C114.2 56.94,6.99 58.28,5.64 62.09,5.64 63.74,3.99 63.74,2.05 62.97,1.27 54.35,1.27 R138.1
N$31
  Bottom 0.203: C115.2 R134.2 52.28,12.43 IC102.8 54.29,12.7 54.73,13.14 54.73,25.59 53.02,27.3 R125.1
N$33
  Bottom 0.203: R129.2 C103.2 52.01,21.43 IC102.14 49.74,20.32 47.11,17.69 47.11,14.93 45.49,13.31 45.49,6.91 46.35,6.05 46.35,6.03 46.84,5.54 53.45,5.54 R137.1
N$34
  Bottom 0.203: VR7.P$2 R107.2
N$38
  Bottom 0.203: VR8.P$2 62.13,72.46 R106.2
OUT1
  Bottom 0.203: R140.2 17.94,3.02 J5.P3
OUT2
  Bottom 0.203: R139.2 32.65,3.02 J6.P3
OUT3
  Bottom 0.203: R138.2 47.36,3.02 J7.P3
OUT4
  Bottom 0.203: J8.P3 61.75,3.02 R137.2
RAW1  (via drill 0.4)
  Top 0.203: v25.72,18.1 25.88,18.26 25.88,100.33 v22.7,103.5
  Bottom 0.203: J1.P3 R100.2 8.68,103.5 v22.7,103.5 | IC100.3 26.04,17.78 v25.72,18.1
RAW2
  Bottom 0.203: J2.P3 R105.2 7.41,70.8 10.03,68.18 10.03,28.25 16.55,21.73 18.29,21.73 20.44,19.58 20.44,19.1 21.1,18.45 23.92,18.45 26.46,15.9 27.02,15.9 IC100.5
RAW3
  Bottom 0.203: J3.P3 R110.2 7.3,62.97 7.3,56.52 8.26,55.56 8.26,28.25 17.31,19.19 19.78,19.19 20.93,18.04 22.22,18.04 IC100.12
RAW4
  Bottom 0.203: IC100.10 R115.2 19.58,15.72 18.64,16.66 17.21,16.66 7.14,26.72 7.14,40.64 5.24,42.55 J4.P3
REF
  Top 0.203: SW1.P$2 4.13,22.86 2.93,24.05 2.93,33.2 4.66,34.92 J4.P2
SWA
  Top 0.203: VR1.P$3 15.07,80.39 15.29,80.17 15.29,78.58 15.28,78.57 VR5.P$3 15.28,67.47 15.12,67.31 15.12,62.25 16.56,60.8 16.56,56.36 15.6,55.39 15.6,52.35 VR9.P$3 15.28,50.73 17.75,48.26 17.75,37.86 15.28,35.39 VR13.P$3 15.28,25.36 SW2.P$2
SWB
  Top 0.203: VR2.P$3 29.85,80.32 30,80.17 30,78.58 29.99,78.57 VR6.P$3 29.99,59.54 30,59.53 30,57.95 29.99,57.93 VR10.P$3 29.99,38.91 30,38.89 30,37.31 29.99,37.3 VR14.P$3 29.99,25.36 SW3.P$2
SWC
  Top 0.203: VR3.P$3 44.63,80.25 44.71,80.17 44.71,78.58 44.7,78.57 VR7.P$3 44.7,59.54 44.71,59.53 44.71,57.95 44.7,57.93 VR11.P$3 44.7,38.91 44.71,38.89 44.71,37.31 44.7,37.3 VR15.P$3 44.7,25.36 SW4.P$2
SWD
  Top 0.203: VR4.P$3 59.41,80.18 59.42,80.17 59.42,78.58 59.41,78.57 VR8.P$3 59.41,59.54 59.42,59.53 59.42,57.95 59.41,57.93 VR12.P$3 59.41,38.91 59.42,38.89 59.42,37.31 59.41,37.3 VR16.P$3 59.41,31.07 63.5,26.99 63.5,24.45 SW5.P$2

### Text on the board
bPlace: -12v | Red stripe
bDocu: Matrix Mixer v1.0, copyright forestcaver 2021